# EAGLE design Tube board v2.1 (EAGLE 7.5.0)
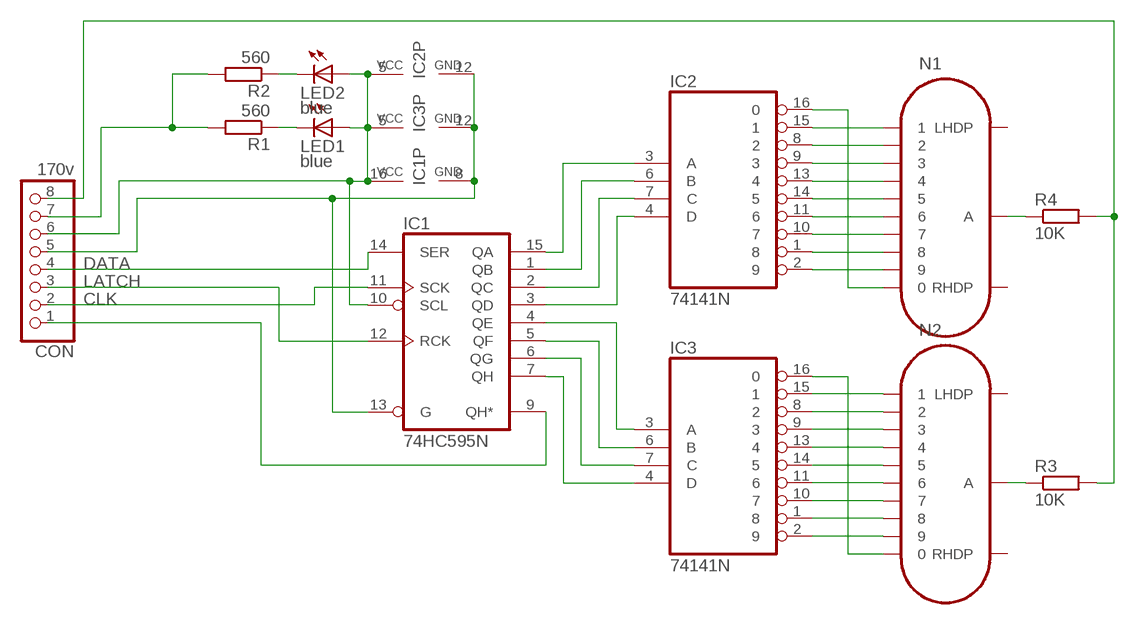
[diagram p0: schematic, sheet 1]

## Parts
CON  170v  PINHD-1X8  [1X08]
IC1  74HC595N  [DIL16]
IC2  74141N  [DIL16]
IC3  74141N  [DIL16]
LED1  blue  LED3MM  [LED3MM]
LED2  blue  LED3MM  [LED3MM]
N1  IN-14  [IN-14]
N2  IN-14  [IN-14]
R1  560  R-EU_0204/7  [0204/7]
R2  560  R-EU_0204/7  [0204/7]
R3  10K  R-EU_0204/7  [0204/7]
R4  10K  R-EU_0204/7  [0204/7]

## Nets
170V: CON.8 R3.2 R4.2
CLK: CON.2 IC1.11(SCK)
DATA: CON.4 IC1.14(SER)
GND: CON.5 IC1.8(GND) IC1.13(G) IC2.12(GND) IC3.12(GND)
LATCH: CON.3 IC1.12(RCK)
N$1: LED1.K(C) R1.1
N$2: CON.7 R1.2 R2.2
N$4: LED2.K(C) R2.1
N$115: IC1.15(QA) IC2.3(A)
N$116: IC1.1(QB) IC2.6(B)
N$117: IC1.2(QC) IC2.7(C)
N$118: IC1.3(QD) IC2.4(D)
N$119: IC1.7(QH) IC3.4(D)
N$120: IC1.6(QG) IC3.7(C)
N$121: IC1.5(QF) IC3.6(B)
N$122: IC1.4(QE) IC3.3(A)
N$123: CON.1 IC1.9(QH*)
N$124: IC2.16 N1.0
N$125: IC2.15 N1.1
N$126: IC2.8 N1.2
N$127: IC2.9 N1.3
N$128: IC2.13 N1.4
N$129: IC2.14 N1.5
N$130: IC2.11 N1.6
N$131: IC2.10 N1.7
N$132: IC2.1 N1.8
N$133: IC2.2 N1.9
N$134: IC3.15 N2.1
N$135: IC3.8 N2.2
N$136: IC3.9 N2.3
N$137: IC3.13 N2.4
N$138: IC3.14 N2.5
N$139: IC3.11 N2.6
N$140: IC3.10 N2.7
N$141: IC3.1 N2.8
N$142: IC3.2 N2.9
N$143: IC3.16 N2.0
N$144: N2.A R3.1
N$145: N1.A R4.1
VCC: CON.6 IC1.10(SCL) IC1.16(VCC) IC2.5(VCC) IC3.5(VCC) LED1.A LED2.A
Unconnected: N1.LHDP N1.RHDP N2.LHDP N2.RHDP

## Library data of the parts
CON = pinhead:PINHD-1X8: PIN HEADER
IC1 = 74xx-eu:74*595: 8-bit SHIFT REGISTER, output latch
IC2 IC3 = 74xx-eu:74*141: BCD to decimal DECODER/DRIVER
LED1 LED2 = led:LED: LED OSRAM: - CHIPLED LG R971, LG N971, LY N971, LG Q971, LY Q971, LO R971, LY R971 LH N974, LH R974 LS Q976, LO Q976, LY Q976 LO Q996 - Hyper CHIPLED LW Q18S LB Q993, LB Q99A, LB R99A - SideLED LS A670, LO A670, LY A670, LG A670, LP A670 LB A673, LV A673, LT A673, LW A673 LH A674 LY A675 LS A676, LA A676, LO A676, LY A676, LW A676 LS A679, LY A679, LG A679 - Hyper Micro SIDELED® LS Y876, LA Y876, LO Y876, LY Y876 LT Y87S - SmartLED LW L88C, LW L88S LB L89C, LB L89S, LG L890 LS L89K, LO L89K, LY L89K LS L896, LA L896, LO L896, LY L896 - TOPLED LS T670, LO T670, LY T670, LG T670, LP T670 LSG T670, LSP T670, LSY T670, LOP T670, LYG T670 LG T671, LOG T671, LSG T671 LB T673, LV T673, LT T673, LW T673 LH T674 LS T676, LA T676, LO T676, LY T676, LB T676, LH T676, LSB T676, LW T676 LB T67C, LV T67C, LT T67C, LS T67K, LO T67K, LY T67K, LW E67C LS E67B, LA E67B, LO E67B, LY E67B, LB E67C, LV E67C, LT E67C LW T67C LS T679, LY T679, LG T679 LS T770, LO T770, LY T770, LG T770, LP T770 LB T773, LV T773, LT T773, LW T773 LH T774 LS E675, LA E675, LY E675, LS T675 LS T776, LA T776, LO T776, LY T776, LB T776 LHGB T686 LT T68C, LB T68C - Hyper Mini TOPLED® LB M676 - Mini TOPLED Santana® LG M470 LS M47K, LO M47K, LY M47K Source: http://www.osram.convergy.de LUXEON: - LUMILED® LXK2-PW12-R00, LXK2-PW12-S00, LXK2-PW14-U00, LXK2-PW14-V00 LXK2-PM12-R00, LXK2-PM12-S00, LXK2-PM14-U00 LXK2-PE12-Q00, LXK2-PE12-R00, LXK2-PE12-S00, LXK2-PE14-T00, LXK2-PE14-U00 LXK2-PB12-K00, LXK2-PB12-L00, LXK2-PB12-M00, LXK2-PB14-N00, LXK2-PB14-P00, LXK2-PB14-Q00 LXK2-PR12-L00, LXK2-PR12-M00, LXK2-PR14-Q00, LXK2-PR14-R00 LXK2-PD12-Q00, LXK2-PD12-R00, LXK2-PD12-S00 LXK2-PH12-R00, LXK2-PH12-S00 LXK2-PL12-P00, LXK2-PL12-Q00, LXK2-PL12-R00 Source: www.luxeon.com KINGBRIGHT: KA-3528ASYC Source: www.kingbright.com
N1 N2 = russian-nixies:IN-14: IN-14: medium numeric frontview nixie tube
R1-R4 = resistor:R-EU_: RESISTOR, European symbol

## Board
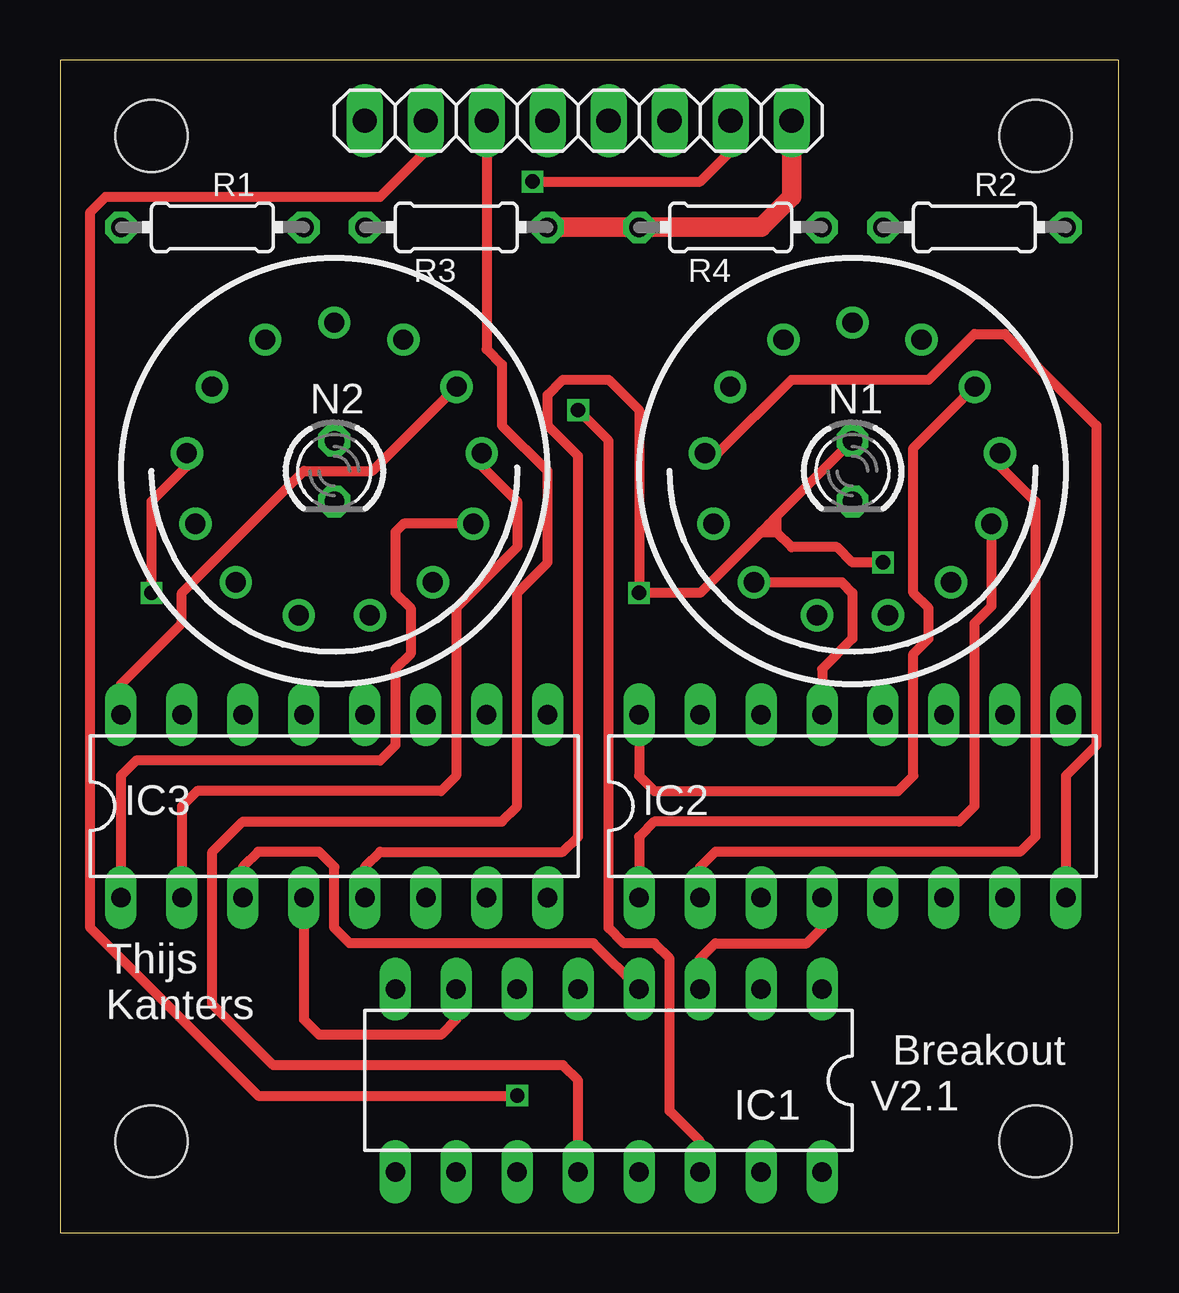
[diagram p1: board, top side]
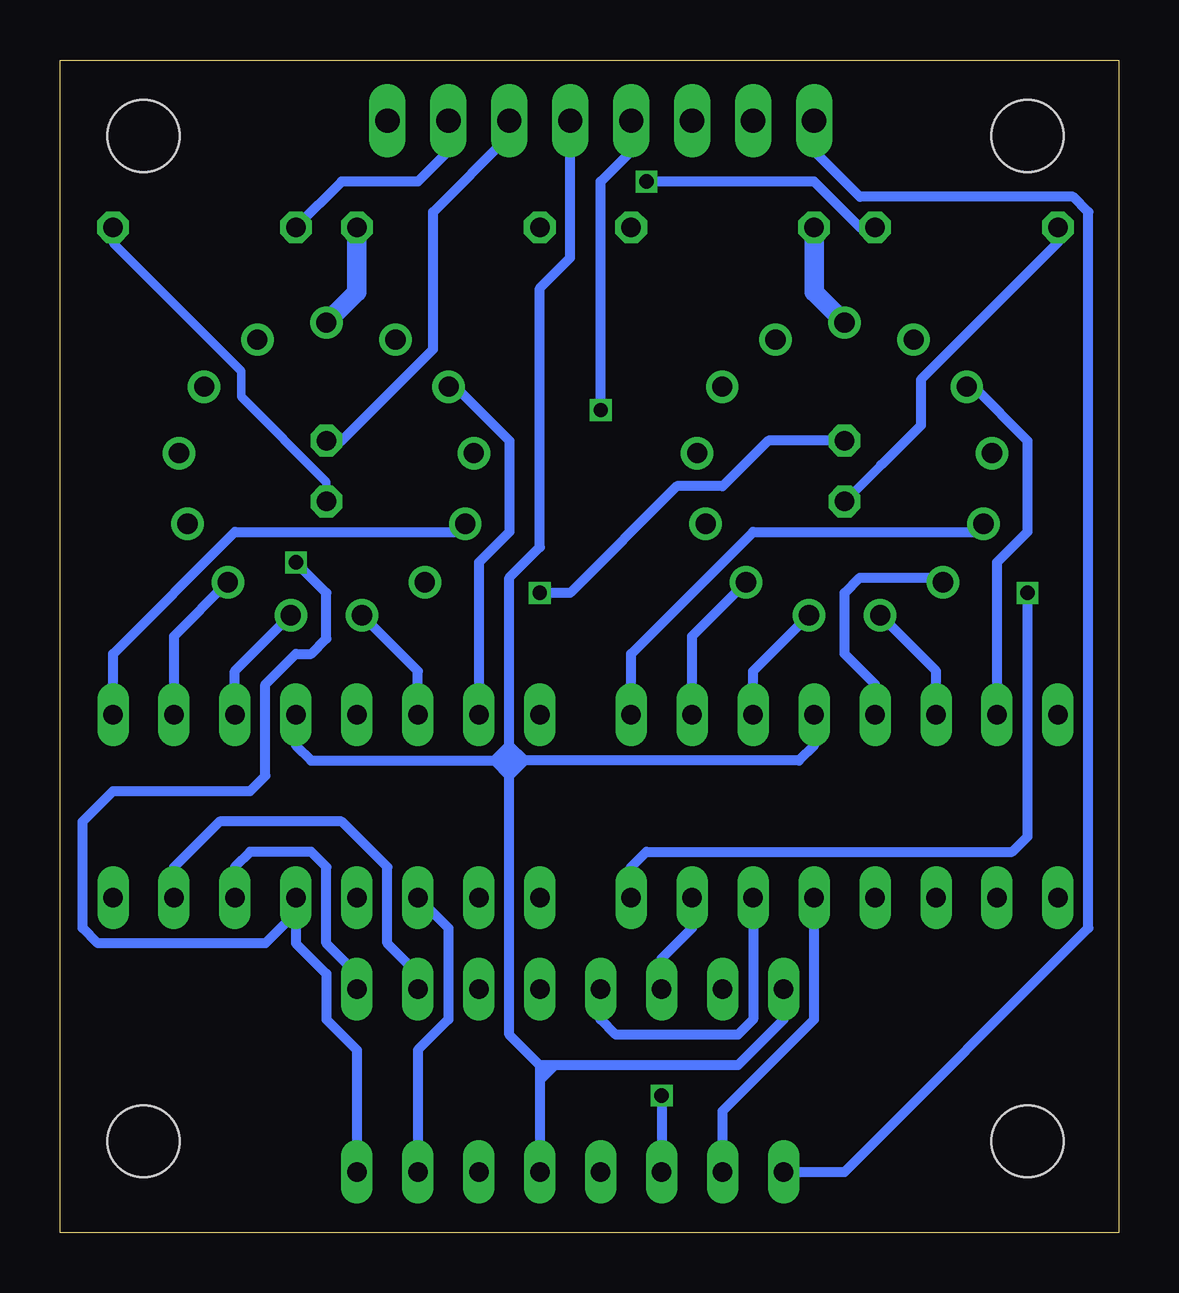
[diagram p2: board, bottom side, seen from below]

Size 44.12 x 48.88 mm. Coordinates in mm from the lower left corner, seen from the top.
Outline: 0,0 44.12,0 44.12,48.88 0,48.88 0,0
Copper layers (1*16): Top 0.035mm / dielectric 1.5mm / Bottom 0.035mm
Design rules "ShenZhen2U EagleRules *": minimum track width 14mil, minimum drill 12mil, track to track 14mil, track to pad 14mil, pad to pad 14mil, via to via 14mil, smd to smd 0mil, copper to edge 20mil, drill to drill 10mil, minimum pad ring 10mil, minimum via ring 6mil, stop-mask expansion 2mil, vias tented up to drill 25mil, thermal gap 14mil
Holes 3 mm at 3.81,3.81 3.81,45.72 40.64,3.81 40.64,45.72

### Footprints (pad centres in the part's own frame; a part is rotated, then mirrored left to right if it is on the bottom)
1X08 = drill 1.016 long: 1 -8.89,0; 2 -6.35,0; 3 -3.81,0; 4 -1.27,0; 5 1.27,0; 6 3.81,0; 7 6.35,0; 8 8.89,0
DIL16 = drill 0.813 long: 1 -8.89,-3.81; 2 -6.35,-3.81; 3 -3.81,-3.81; 4 -1.27,-3.81; 5 1.27,-3.81; 6 3.81,-3.81; 7 6.35,-3.81; 8 8.89,-3.81; 9 8.89,3.81; 10 6.35,3.81; 11 3.81,3.81; 12 1.27,3.81; 13 -1.27,3.81; 14 -3.81,3.81; 15 -6.35,3.81; 16 -8.89,3.81
LED3MM = drill 0.813 octagon: A -1.27,0; K 1.27,0
IN-14 = drill 0.84: 0 -5.094,-3.516; 1 5.094,-3.516; 2 6.145,-0.746; 3 5.788,2.195; 4 4.105,4.633; 5 1.481,6.01; 6 -1.481,6.01; 7 -4.105,4.633; 8 -5.788,2.195; 9 -6.145,-0.746; A 0,-6.19; LHDP 2.877,-5.481; RHDP -2.877,-5.481
0204/7 = drill 0.813 octagon: 1 -3.81,0; 2 3.81,0

### Placement (x,y rotation side)
CON  21.59,46.35 0 top
IC1  22.86,6.35 180 top
IC2  33.02,17.78 0 top
IC3  11.43,17.78 0 top
LED1  11.43,31.75 270 top
LED2  33.02,31.75 270 top
N1  33.02,31.75 180 top
N2  11.43,31.75 180 top
R1  6.35,41.91 0 top
R2  38.1,41.91 180 top
R3  16.51,41.91 0 top
R4  27.94,41.91 180 top

### Tracks (layer width: path | path; a pad name or v marks a point on that pad's centre or on a via)
170V
  Top 0.813: R3.2 R4.2 29.21,41.91 30.48,43.18 CON.8
CLK  (via drill 0.6)
  Top 0.406: CON.2 15.24,45.09 13.34,43.18 1.91,43.18 1.27,42.55 1.27,12.7 8.25,5.71 v19.05,5.71
  Bottom 0.406: v19.05,5.71 IC1.11
DATA  (via drill 0.6)
  Top 0.406: IC1.14 26.67,3.81 25.4,5.08 25.4,11.43 24.77,12.06 23.5,12.06 22.86,12.7 22.86,33.02 v21.59,34.29
  Bottom 0.406: v21.59,34.29 21.59,43.81 20.32,45.09 CON.4
GND
  Bottom 0.406: IC1.8 13.97,8.89 15.88,6.99 23.5,6.99 | 24.13,6.99 24.13,6.35 | 24.13,6.35 IC1.13 | 23.5,6.99 24.13,6.99 | 24.13,6.99 25.4,8.26 25.4,19.05 | 23.5,6.99 24.13,6.35 | IC3.12 12.7,20.32 13.34,19.68 24.77,19.68 | 24.77,19.68 25.4,19.05 | IC2.12 34.29,20.32 33.66,19.68 26.04,19.68 | 26.04,19.68 25.4,19.05 | 26.04,19.68 25.4,19.68 | 25.4,19.68 25.4,19.05 | 24.77,19.68 25.4,19.68 | 25.4,19.68 25.4,20.32 | 25.4,20.32 25.4,27.3 24.13,28.57 24.13,39.37 22.86,40.64 CON.5 | 24.77,19.68 25.4,20.32 | 25.4,20.32 26.04,19.68
LATCH
  Top 0.406: IC1.12 21.59,6.35 20.96,6.99 8.89,6.99 6.35,9.53 6.35,15.88 7.62,17.14 18.41,17.14 19.05,17.78 19.05,26.67 20.32,27.94 20.32,31.75 18.41,33.66 18.41,36.2 17.78,36.83 CON.3
N$1
  Bottom 0.356: LED1.K 9.91,32
  Bottom 0.406: R1.1 2.54,41.27 8.25,35.56 8.25,33.66 9.91,32
N$2  (via drill 0.6)
  Top 0.406: v19.69,43.81 26.67,43.81 27.94,45.09 CON.7
  Bottom 0.406: CON.7 27.94,45.09 29.21,43.81 32.38,43.81 R2.2 | R1.2 10.8,41.91 12.7,43.81 v19.69,43.81
N$4
  Bottom 0.356: LED2.K 33.02,31.29 36.58,34.85 36.58,35.92 41.91,41.25 R2.1
N$115
  Bottom 0.406: IC2.3 27.94,12.7 27.94,8.89 29.21,7.62 IC1.15
N$116
  Bottom 0.406: IC1.1 31.75,10.79 33.02,12.06 33.02,15.24 33.66,15.88 36.2,15.88 36.83,15.24 IC2.6
N$117
  Bottom 0.406: IC1.2 29.21,10.79 30.48,12.06 30.48,15.24 32.38,17.14 37.47,17.14 39.37,15.24 IC2.7
N$118
  Top 0.406: IC1.3 26.67,11.43 27.3,12.06 31.12,12.06 31.75,12.7 IC2.4
N$119
  Top 0.406: IC3.4 10.16,8.89 10.8,8.26 15.88,8.26 16.51,8.89 IC1.7
N$120
  Bottom 0.406: IC3.7 17.78,12.7 19.05,11.43 IC1.6
N$121
  Bottom 0.406: IC3.6 15.24,8.89 15.88,8.26 20.96,8.26 21.59,8.89 IC1.5
N$122
  Top 0.406: IC1.4 22.23,12.06 12.07,12.06 11.43,12.7 11.43,15.24 10.8,15.88 8.25,15.88 7.62,15.24 IC3.3
N$123
  Bottom 0.406: IC1.9 11.43,2.54 1.27,12.7 1.27,42.55 1.91,43.18 10.8,43.18 12.7,45.09 CON.1
N$124
  Top 0.406: N1.0 35.56,32.71 35.56,26.67 36.2,26.04 36.2,24.77 35.56,24.13 35.56,19.05 34.93,18.41 24.77,18.41 24.13,19.05 IC2.16
N$125
  Bottom 0.406: N1.1 27.65,35.27 25.4,33.02 25.4,29.21 26.67,27.94 IC2.15
N$126
  Top 0.406: N1.2 27.42,32.5 30.48,35.56 36.2,35.56 38.1,37.47 39.37,37.47 43.18,33.66 43.18,20.32 41.91,19.05 IC2.8
N$127
  Bottom 0.406: IC2.9 41.91,24.13 36.83,29.21 27.58,29.21 N1.3
N$128
  Top 0.406: N1.4 32.57,27.12 33.02,26.67 33.02,24.77 31.75,23.5 IC2.13
N$129
  Bottom 0.406: IC2.14 29.21,23.41 N1.5
N$130
  Bottom 0.406: IC2.11 36.83,23.41 N1.6
N$131
  Bottom 0.406: IC2.10 39.37,24.87 N1.7
N$132
  Top 0.406: N1.8 38.81,26.11 38.1,25.4 38.1,17.78 37.47,17.14 24.77,17.14 24.13,16.51 IC2.1
N$133
  Top 0.406: N1.9 39.16,31.95 40.64,30.48 40.64,16.51 40.01,15.88 27.3,15.88 26.67,15.24 IC2.2
N$134
  Bottom 0.406: N2.1 6.06,35.27 3.81,33.02 3.81,29.21 5.08,27.94 IC3.15
N$135  (via drill 0.6)
  Top 0.406: N2.2 5.29,31.95 3.81,30.48 v3.81,26.67
  Bottom 0.406: v3.81,26.67 3.81,16.51 4.45,15.88 19.69,15.88 20.32,15.24 IC3.8
N$136
  Bottom 0.406: IC3.9 20.32,24.13 15.24,29.21 5.99,29.21 N2.3
N$137
  Bottom 0.406: IC3.13 10.16,22.86 11.43,24.13 11.43,26.67 10.8,27.3 7.51,27.3 N2.4
N$138
  Bottom 0.406: IC3.14 7.62,23.41 N2.5
N$139
  Bottom 0.406: IC3.11 15.24,23.41 N2.6
N$140
  Bottom 0.406: IC3.10 17.78,24.87 N2.7
N$141
  Top 0.406: IC3.1 2.54,19.05 3.17,19.68 13.34,19.68 13.97,20.32 13.97,23.5 14.61,24.13 14.61,26.04 13.97,26.67 13.97,29.21 14.32,29.55 N2.8
N$142
  Top 0.406: N2.9 17.57,31.95 19.05,30.48 19.05,28.57 16.51,26.04 16.51,19.05 15.88,18.41 5.72,18.41 5.08,17.78 IC3.2
N$143
  Top 0.406: N2.0 13.01,31.75 10.16,31.75 5.08,26.67 5.08,25.4 2.54,22.86 IC3.16
N$144
  Bottom 0.813: R3.1 12.7,39.21 N2.A
N$145
  Bottom 0.813: R4.1 31.75,39.21 N1.A
VCC  (via drill 0.6)
  Top 0.406: 29.21,29.21 26.67,26.67 v24.13,26.67 24.13,34.29 22.86,35.56 20.96,35.56 20.32,34.92 20.32,33.66 21.59,32.38 21.59,16.51 20.96,15.88 13.34,15.88 12.7,15.24 IC3.5 | 29.21,29.21 29.53,29.53 | 29.53,29.53 29.84,29.84 | 29.84,29.84 LED2.A | v34.29,27.94 33.02,27.94 32.38,28.57 30.48,28.57 29.84,29.21 | 29.84,29.21 29.53,29.53 | 29.84,29.84 29.84,29.21 | 29.21,29.21 29.84,29.21
  Bottom 0.406: 34.29,13.34 34.29,12.06 33.02,10.79 33.02,8.89 31.75,7.62 IC1.16 | LED2.A 32.38,33.02 28.57,36.83 28.57,42.55 25.4,45.72 CON.6 | LED1.A 14.61,33.02 16.51,31.11 18.41,31.11 22.86,26.67 v24.13,26.67 | IC2.5 34.29,13.34 | 34.29,13.34 35.56,12.06 42.55,12.06 43.18,12.7 43.18,17.14 41.91,18.41 36.2,18.41 35.56,19.05 35.56,22.86 34.29,24.13 33.66,24.13 33.02,24.77 33.02,26.67 v34.29,27.94 | IC1.10 16.51,5.08 12.7,8.89 IC3.5

### Text on the board
tPlace: Thijs | Kanters
tNames: Breakout | V2.1